# EAGLE design roboimplantschematic (EAGLE 6.1)
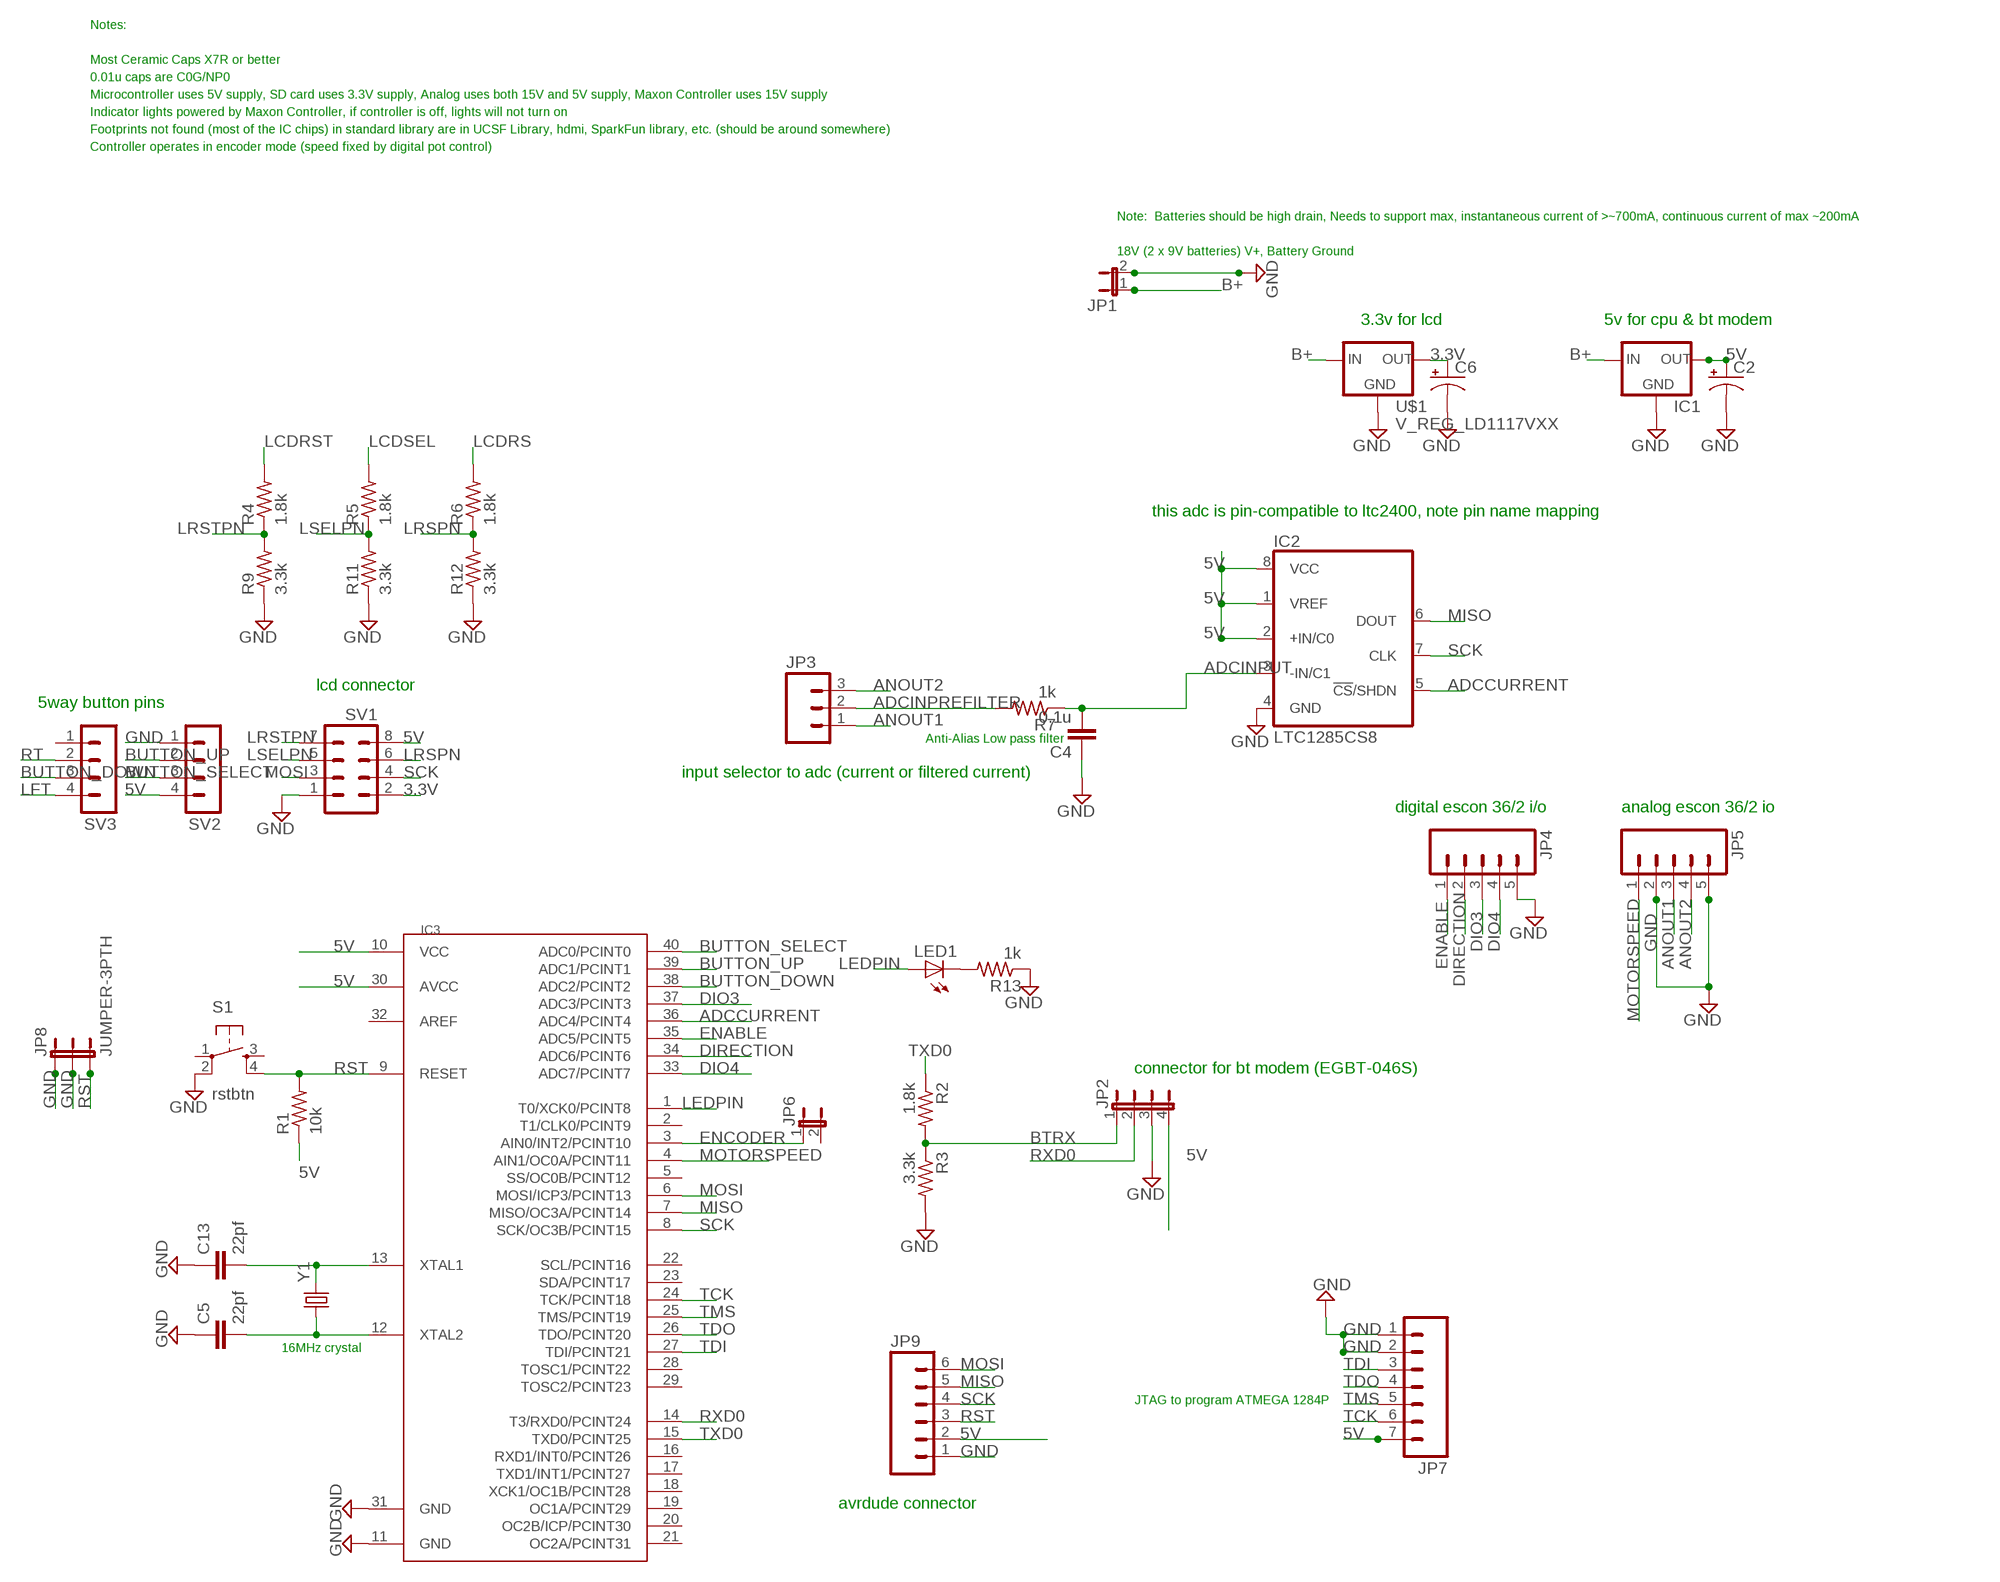
[diagram p0: schematic, sheet 1]

## Parts
C2  CAP_POLPTH2  [CPOL-RADIAL-10UF-25V]
C4  0.1u  050X030_0251  [050X030_025]
C5  22pf  050X030_0251  [050X030_025]
C6  CAP_POLPTH2  [CPOL-RADIAL-10UF-25V]
C13  22pf  050X030_0251  [050X030_025]
IC1  V_REG_78XX-TO-220  [TO-220-ALT]
IC2  LTC1285CS8  [SOIC8]
IC3  MEGA1284P  [DIL40]
JP1  JP1E  [JP1]
JP2  JP4E  [JP4]
JP3  M03LOCK_LONGPADS  [1X03_LOCK_LONGPADS]
JP4  M05PTH_LONGPADS  [1X05_LONGPADS]
JP5  M05PTH_LONGPADS  [1X05_LONGPADS]
JP6  JUMPER-2PTH  [1X02]
JP7  M07LOCK  [1X07_LOCK]
JP8  JUMPER-3PTH  [1X03]
JP9  M06SIP_LOCK  [1X06-SIP_LOCK]
LED1  LED5MM  [LED5MM]
R1  10k  R-US_0204/7  [0204/7]
R2  1.8k  R-US_0207/2V  [0207/2V]
R3  3.3k  R-US_0207/2V  [0207/2V]
R4  1.8k  R-US_0207/2V  [0207/2V]
R5  1.8k  R-US_0207/2V  [0207/2V]
R6  1.8k  R-US_0207/2V  [0207/2V]
R7  1k  R-US_0207/2V  [0207/2V]
R9  3.3k  R-US_0207/2V  [0207/2V]
R11  3.3k  R-US_0207/2V  [0207/2V]
R12  3.3k  R-US_0207/2V  [0207/2V]
R13  1k  R-US_0207/2V  [0207/2V]
S1  rstbtn  TAC_SWITCHPTH  [TACTILE-PTH]
SV1  MA04-2  [MA04-2]
SV2  MA04-1  [MA04-1]
SV3  MA04-1  [MA04-1]
U$1  V_REG_LD1117VXX  [78XXL]
Y1  CRYSTALHC49US  [HC49US]

## Nets
3.3V: C6.1(+) SV1.2 U$1.GND(OUT)
5V: C2.1(+) IC1.OUT IC2.1(VREF) IC2.2(+IN/C0) IC2.8(VCC) IC3.10(VCC) IC3.30(AVCC) JP2.4 JP7.7 JP9.2 R1.1 SV1.8 SV2.4
ADCCURRENT: IC2.5(!CS!/SHDN) IC3.36(ADC4/PCINT4)
ADCINPREFILTER: JP3.2 R7.2
ADCINPUT: C4.2 IC2.3(-IN/C1) R7.1
ANOUT1: JP3.1 JP5.3
ANOUT2: JP3.3 JP5.4
B+: IC1.IN JP1.1 U$1.OUT(IN)
BTRX: JP2.1 R2.2 R3.1
BUTTON_DOWN: IC3.38(ADC2/PCINT2) SV3.3
BUTTON_SELECT: IC3.40(ADC0/PCINT0) SV2.3
BUTTON_UP: IC3.39(ADC1/PCINT1) SV2.2
DIO3: IC3.37(ADC3/PCINT3) JP4.3
DIO4: IC3.33(ADC7/PCINT7) JP4.4
DIRECTION: IC3.34(ADC6/PCINT6) JP4.2
ENABLE: IC3.35(ADC5/PCINT5) JP4.1
ENCODER: IC3.3(AIN0/INT2/PCINT10) JP6.1
GND: C2.2(-) C4.1 C5.1 C6.2(-) C13.1 IC1.GND IC2.4(GND) IC3.11(GND) IC3.31(GND) JP1.2 JP2.3 JP4.5 JP5.2 JP5.5 JP7.1 JP7.2 JP8.1 JP8.2 JP9.1 R3.2 R9.1 R11.1 R12.1 R13.1 S1.2 SV1.1 SV2.1 U$1.IN(GND)
LCDRS: R6.2
LCDRST: R4.2
LCDSEL: R5.2
LEDPIN: IC3.1(T0/XCK0/PCINT8) LED1.A
LFT: SV3.4
LRSPN: R6.1 R12.2 SV1.6
LRSTPN: R4.1 R9.2 SV1.7
LSELPN: R5.1 R11.2 SV1.5
MISO: IC2.6(DOUT) IC3.7(MISO/OC3A/PCINT14) JP9.5
MOSI: IC3.6(MOSI/ICP3/PCINT13) JP9.6 SV1.3
MOTORSPEED: IC3.4(AIN1/OC0A/PCINT11) JP5.1
N$1: C5.2 IC3.12(XTAL2) Y1.1
N$2: C13.2 IC3.13(XTAL1) Y1.2
N$5: LED1.K(C) R13.2
RST: IC3.9(RESET) JP8.3 JP9.3 R1.2 S1.4
RT: SV3.2
RXD0: IC3.14(T3/RXD0/PCINT24) JP2.2
SCK: IC2.7(CLK) IC3.8(SCK/OC3B/PCINT15) JP9.4 SV1.4
TCK: IC3.24(TCK/PCINT18) JP7.6
TDI: IC3.27(TDI/PCINT21) JP7.3
TDO: IC3.26(TDO/PCINT20) JP7.4
TMS: IC3.25(TMS/PCINT19) JP7.5
TXD0: IC3.15(TXD0/PCINT25) R2.1
Unconnected: IC3.2(T1/CLK0/PCINT9) IC3.5(SS/OC0B/PCINT12) IC3.16(RXD1/INT0/PCINT26) IC3.17(TXD1/INT1/PCINT27) IC3.18(XCK1/OC1B/PCINT28) IC3.19(OC1A/PCINT29) IC3.20(OC2B/ICP/PCINT30) IC3.21(OC2A/PCINT31) IC3.22(SCL/PCINT16) IC3.23(SDA/PCINT17) IC3.28(TOSC1/PCINT22) IC3.29(TOSC2/PCINT23) IC3.32(AREF) JP6.2 S1.1 S1.3 SV3.1

## Notes on the sheet
- Notes:
- Most Ceramic Caps X7R or better
- 0.01u caps are C0G/NP0
- Microcontroller uses 5V supply, SD card uses 3.3V supply, Analog uses both 15V and 5V supply, Maxon Controller uses 15V supply
- Indicator lights powered by Maxon Controller, if controller is off, lights will not turn on
- Footprints not found (most of the IC chips) in standard library are in UCSF Library, hdmi, SparkFun library, etc. (should be around somewhere)
- Controller operates in encoder mode (speed fixed by digital pot control)
- Note:  Batteries should be high drain, Needs to support max, instantaneous current of >~700mA, continuous current of max ~200mA
- 18V (2 x 9V batteries) V+, Battery Ground
- 3.3v for lcd | 5v for cpu & bt modem
- this adc is pin-compatible to ltc2400, note pin name mapping
- lcd connector
- 5way button pins
- Anti-Alias Low pass filter
- input selector to adc (current or filtered current)
- digital escon 36/2 i/o | analog escon 36/2 io
- connector for bt modem (EGBT-046S)
- 16MHz crystal
- JTAG to program ATMEGA 1284P
- avrdude connector

## Library data of the parts
C2 C6 = SparkFun:CAP_POL: Capacitor Polarized These are standard SMD and PTH capacitors. Normally 10uF, 47uF, and 100uF in electrolytic and tantalum varieties. Always verify the external diameter of the through hole cap, it varies with capacity, voltage, and manufacturer. The EIA devices should be standard.
C4 C5 C13 = gm-caps-ceramic:050X030_025: 47 - 120pF Xicon Ceramic Disc 2.5mm lead spacing
IC1 = SparkFun:V_REG_78XX: Voltage Regulator Standard 7805 5V regulator. IGO (Input Ground Output). Spark Fun Electronics SKU : COM-00107
IC2 = linear-technology:LTC128*C: 3V Micropower Sampling 12-Bit A/D Converters Source: http://www.linear.com/pc/downloadDocument.do?navId=H0,C1,C1155,C1001,C1158,P1489,D3463; MPN: LTC1285CS8; OC_FARNELL: 4767585; OC_NEWARK: 56M0033
IC3 = 1284p:MEGA1284P: Atmel ATmega1284P 8-bit AVR Microcontroller
JP1 = jumper:JP1E: JUMPER
JP2 = jumper:JP4E: JUMPER
JP3 = SparkFun:M03: Header 3 Standard 3-pin 0.1" header. Use with straight break away headers (SKU : PRT-00116), right angle break away headers (PRT-00553), swiss pins (PRT-00743), machine pins (PRT-00117), and female headers (PRT-00115). Molex polarized connector foot print use with SKU : PRT-08232 with associated crimp pins and housings.
JP4 JP5 = SparkFun:M05: Header 5 Standard 5-pin 0.1" header. Use with straight break away headers (SKU : PRT-00116), right angle break away headers (PRT-00553), swiss pins (PRT-00743), machine pins (PRT-00117), and female headers (PRT-00115). Molex polarized connector foot print use with SKU : PRT-08230 with associated crimp pins and housings.
JP6 = SparkFun:JUMPER-2: Jumper Basic 0.1" spaced jumper. Use with breakaway headers.
JP7 = SparkFun:M07: Header 7 Standard 7-pin 0.1" header. Use with straight break away headers (SKU : PRT-00116), right angle break away headers (PRT-00553), swiss pins (PRT-00743), machine pins (PRT-00117), and female headers (PRT-00115). NOTES ON THE VARIANTS LOCK and LOCK_LONGPADS... This footprint was designed to help hold the alignment of a through-hole component (i.e. 7-pin header) while soldering it into place. You may notice that each hole has been shifted either up or down by 0.005 of an inch from it's more standard position (which is usually a perfectly straight line). This slight alteration caused the pins (the squares in the middle) to touch the edges of the holes. Because they are alternating, it causes a "brace" to hold the header in place. 0.005 has proven to be the perfect amount of "off-center" position when using our standard breakaway headers. Although looks a little odd when you look at the bare footprint, once you have a header in there, the alteration is very hard to notice. Also, if you push a header all the way into place, it is covered up entirely on the bottom side. This idea of altering the position of holes to aid alignment will be further integrated into the Sparkfun Library for other footprints. It can help hold any component with 3 or more connection pins.
JP8 = SparkFun:JUMPER-3
JP9 = SparkFun:M06: Header 6 Standard 6-pin 0.1" header. Use with straight break away headers (SKU : PRT-00116), right angle break away headers (PRT-00553), swiss pins (PRT-00743), machine pins (PRT-00117), and female headers (PRT-00115). Molex polarized connector foot print use with SKU : PRT-08094 with associated crimp pins and housings. NOTES ON THE VARIANTS LOCK and LOCK_LONGPADS... This footprint was designed to help hold the alignment of a through-hole component (i.e. 6-pin header) while soldering it into place. You may notice that each hole has been shifted either up or down by 0.005 of an inch from it's more standard position (which is a perfectly straight line). This slight alteration caused the pins (the squares in the middle) to touch the edges of the holes. Because they are alternating, it causes a "brace" to hold the component in place. 0.005 has proven to be the perfect amount of "off-center" position when using our standard breakaway headers. Although looks a little odd when you look at the bare footprint, once you have a header in there, the alteration is very hard to notice. Also, if you push a header all the way into place, it is covered up entirely on the bottom side. This idea of altering the position of holes to aid alignment will be further integrated into the Sparkfun Library for other footprints. It can help hold any component with 3 or more connection pins.
LED1 = led:LED: LED OSRAM: - CHIPLED LG R971, LG N971, LY N971, LG Q971, LY Q971, LO R971, LY R971 LH N974, LH R974 LS Q976, LO Q976, LY Q976 LO Q996 - Hyper CHIPLED LW Q18S LB Q993, LB Q99A, LB R99A - SideLED LS A670, LO A670, LY A670, LG A670, LP A670 LB A673, LV A673, LT A673, LW A673 LH A674 LY A675 LS A676, LA A676, LO A676, LY A676, LW A676 LS A679, LY A679, LG A679 - Hyper Micro SIDELED® LS Y876, LA Y876, LO Y876, LY Y876 LT Y87S - SmartLED LW L88C, LW L88S LB L89C, LB L89S, LG L890 LS L89K, LO L89K, LY L89K LS L896, LA L896, LO L896, LY L896 - TOPLED LS T670, LO T670, LY T670, LG T670, LP T670 LSG T670, LSP T670, LSY T670, LOP T670, LYG T670 LG T671, LOG T671, LSG T671 LB T673, LV T673, LT T673, LW T673 LH T674 LS T676, LA T676, LO T676, LY T676, LB T676, LH T676, LSB T676, LW T676 LB T67C, LV T67C, LT T67C, LS T67K, LO T67K, LY T67K, LW E67C LS E67B, LA E67B, LO E67B, LY E67B, LB E67C, LV E67C, LT E67C LW T67C LS T679, LY T679, LG T679 LS T770, LO T770, LY T770, LG T770, LP T770 LB T773, LV T773, LT T773, LW T773 LH T774 LS E675, LA E675, LY E675, LS T675 LS T776, LA T776, LO T776, LY T776, LB T776 LHGB T686 LT T68C, LB T68C - Hyper Mini TOPLED® LB M676 - Mini TOPLED Santana® LG M470 LS M47K, LO M47K, LY M47K Source: http://www.osram.convergy.de LUXEON: - LUMILED® LXK2-PW12-R00, LXK2-PW12-S00, LXK2-PW14-U00, LXK2-PW14-V00 LXK2-PM12-R00, LXK2-PM12-S00, LXK2-PM14-U00 LXK2-PE12-Q00, LXK2-PE12-R00, LXK2-PE12-S00, LXK2-PE14-T00, LXK2-PE14-U00 LXK2-PB12-K00, LXK2-PB12-L00, LXK2-PB12-M00, LXK2-PB14-N00, LXK2-PB14-P00, LXK2-PB14-Q00 LXK2-PR12-L00, LXK2-PR12-M00, LXK2-PR14-Q00, LXK2-PR14-R00 LXK2-PD12-Q00, LXK2-PD12-R00, LXK2-PD12-S00 LXK2-PH12-R00, LXK2-PH12-S00 LXK2-PL12-P00, LXK2-PL12-Q00, LXK2-PL12-R00 Source: www.luxeon.com KINGBRIGHT: KA-3528ASYC Source: www.kingbright.com
R1-R7 R9 R11-R13 = rcl:R-US_: RESISTOR, American symbol
S1 = SparkFun:TAC_SWITCH: Momentary Switch Button commonly used for reset or general input. Spark Fun Electronics SKU : COM-00097
SV1 = con-lstb:MA04-2: PIN HEADER; OC_FARNELL: unknown; OC_NEWARK: unknown
SV2 SV3 = con-lstb:MA04-1: PIN HEADER; OC_FARNELL: unknown; OC_NEWARK: unknown
U$1 = SparkFun:V_REG_LD1117VXX: LD1117VXX voltage regulator. We carry the 3.3V version (COM-00526) in TO-220 package.
Y1 = SparkFun:CRYSTAL: Crystals Various standard crystals. Proven footprints. Spark Fun Electronics SKU : COM-00534

## Board
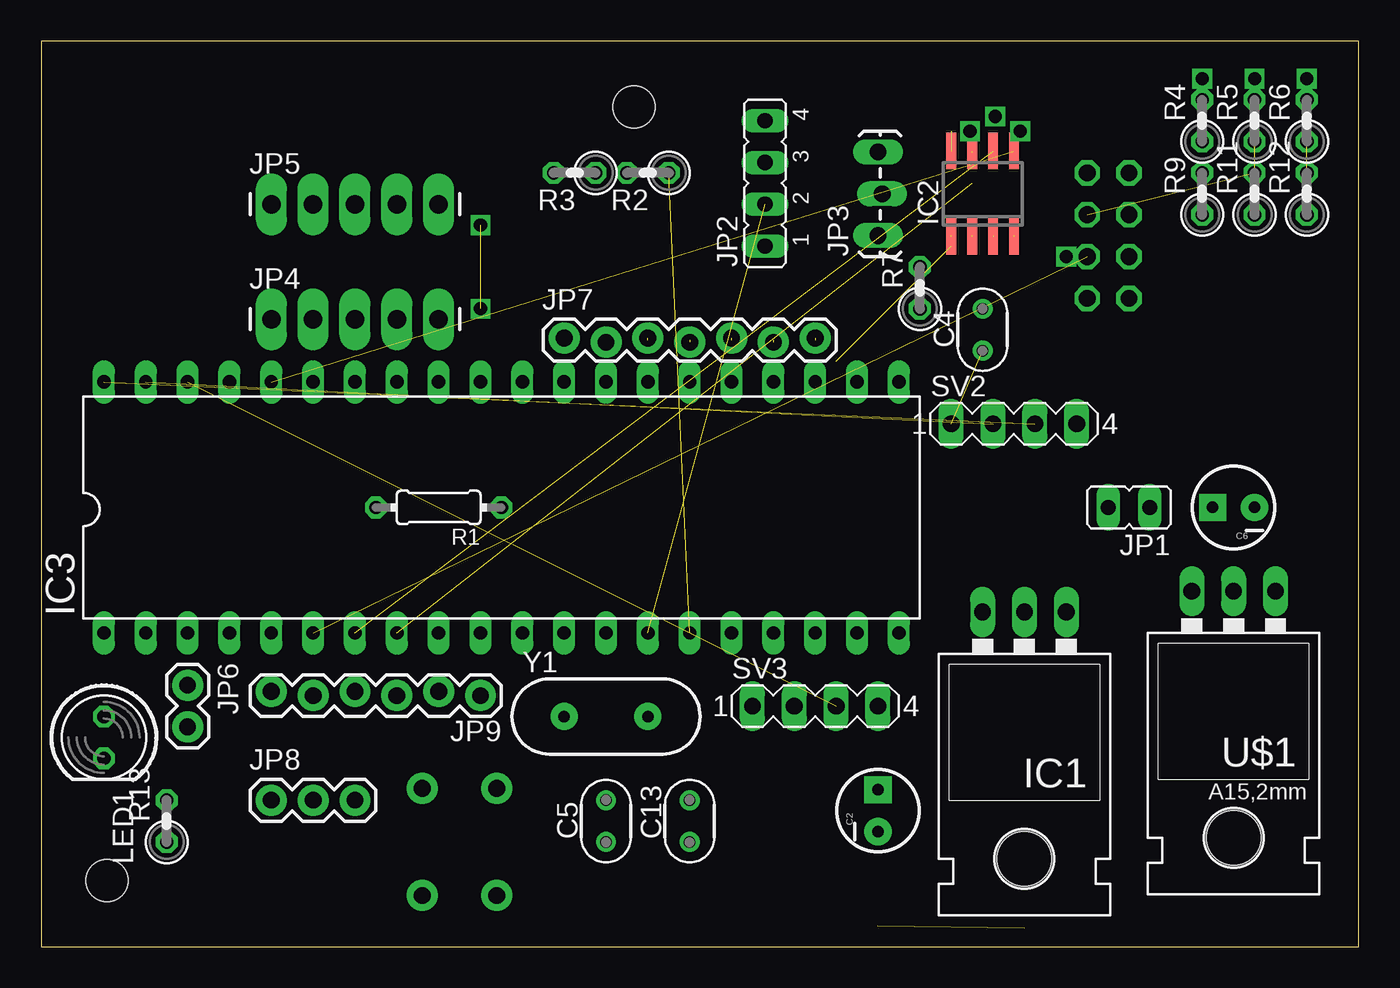
[diagram p1: board, top side]
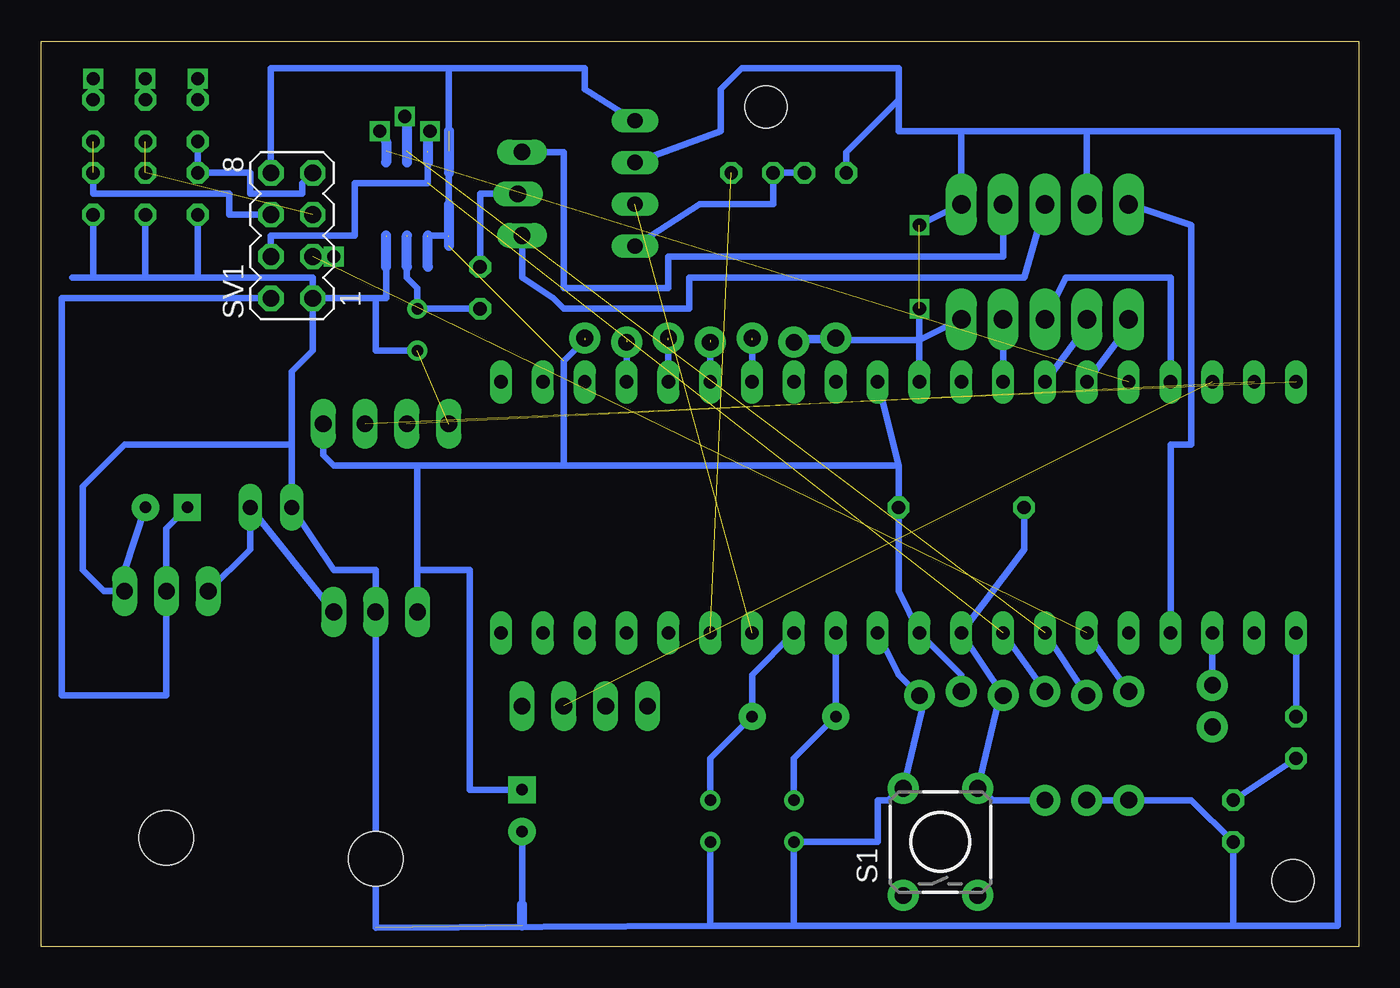
[diagram p2: board, bottom side, seen from below]

Size 79.99 x 54.99 mm. Coordinates in mm from the lower left corner, seen from the top.
Outline: 0,0 79.99,0 79.99,54.99 0,54.99 0,0
Copper layers (1*16): Top 0.035mm / dielectric 1.5mm / Bottom 0.035mm
Design rules: minimum track width 10mil, minimum drill 24mil, track to track 8mil, track to pad 8mil, pad to pad 8mil, via to via 8mil, smd to smd 8mil, copper to edge 40mil, drill to drill 8mil, minimum pad ring 10mil, minimum via ring 8mil, stop-mask expansion 4mil, vias tented up to drill 0mil, thermal gap 10mil
Holes 2.54 mm at 4,4 36,51

### Footprints (pad centres in the part's own frame; a part is rotated, then mirrored left to right if it is on the bottom)
CPOL-RADIAL-10UF-25V = drill 0.7 pad 1.651 square: 1 1.27,0 | drill 0.7 pad 1.651: 2 -1.27,0
050X030_025 = drill 0.7: 1 -1.27,0; 2 1.27,0
TO-220-ALT = drill 1.016 long: GND 0,-3.81; IN -2.54,-3.81; OUT 2.54,-3.81 | hole 3.302: 0,11.176
SOIC8 = smd 0.6 x 2.2: 1 -1.905,-2.6; 2 -0.635,-2.6; 3 0.635,-2.6; 4 1.905,-2.6; 5 1.905,2.6; 6 0.635,2.6; 7 -0.635,2.6; 8 -1.905,2.6
DIL40 = drill 0.813 long: 1 -24.13,-7.62; 2 -21.59,-7.62; 3 -19.05,-7.62; 4 -16.51,-7.62; 5 -13.97,-7.62; 6 -11.43,-7.62; 7 -8.89,-7.62; 8 -6.35,-7.62; 9 -3.81,-7.62; 10 -1.27,-7.62; 11 1.27,-7.62; 12 3.81,-7.62; 13 6.35,-7.62; 14 8.89,-7.62; 15 11.43,-7.62; 16 13.97,-7.62; 17 16.51,-7.62; 18 19.05,-7.62; 19 21.59,-7.62; 20 24.13,-7.62; 21 24.13,7.62; 22 21.59,7.62; 23 19.05,7.62; 24 16.51,7.62; 25 13.97,7.62; 26 11.43,7.62; 27 8.89,7.62; 28 6.35,7.62; 29 3.81,7.62; 30 1.27,7.62; 31 -1.27,7.62; 32 -3.81,7.62; 33 -6.35,7.62; 34 -8.89,7.62; 35 -11.43,7.62; 36 -13.97,7.62; 37 -16.51,7.62; 38 -19.05,7.62; 39 -21.59,7.62; 40 -24.13,7.62
JP1 = drill 0.914 long: 1 0,-1.27; 2 0,1.27
JP4 = drill 0.914 long: 1 -3.81,0; 2 -1.27,0; 3 1.27,0; 4 3.81,0
1X03_LOCK_LONGPADS = drill 1.016 long: 1 0,0; 2 2.54,-0.254; 3 5.08,0
1X05_LONGPADS = drill 1.118 pad 1.88 long: 1 0,0; 2 2.54,0; 3 5.08,0; 4 7.62,0; 5 10.16,0
1X02 = drill 1.016 pad 1.88: 1 0,0; 2 2.54,0
1X07_LOCK = drill 1.016 pad 1.88: 1 0,0.127; 2 2.54,-0.127; 3 5.08,0.127; 4 7.62,-0.127; 5 10.16,0.127; 6 12.7,-0.127; 7 15.24,0.127
1X03 = drill 1.016 pad 1.88: 1 0,0; 2 2.54,0; 3 5.08,0
1X06-SIP_LOCK = drill 1.016 pad 1.88: 1 0,0; 2 2.54,-0.254; 3 5.08,0; 4 7.62,-0.254; 5 10.16,0; 6 12.7,-0.254
LED5MM = drill 0.813 octagon: A -1.27,0; K 1.27,0
0204/7 = drill 0.813 octagon: 1 -3.81,0; 2 3.81,0
0207/2V = drill 0.813 octagon: 1 -1.27,0; 2 1.27,0
TACTILE-PTH = drill 1.016 pad 1.88: 1 -3.251,2.261; 2 3.251,2.261; 3 -3.251,-2.261; 4 3.251,-2.261
MA04-2 = drill 1.016 octagon: 1 -3.81,-1.27; 2 -3.81,1.27; 3 -1.27,-1.27; 4 -1.27,1.27; 5 1.27,-1.27; 6 1.27,1.27; 7 3.81,-1.27; 8 3.81,1.27
MA04-1 = drill 1.016 long: 1 -3.81,0; 2 -1.27,0; 3 1.27,0; 4 3.81,0
78XXL = drill 1.016 long: GND 0,-3.81; IN -2.54,-3.81; OUT 2.54,-3.81 | hole 3.302: 0,11.176
HC49US = drill 0.7 pad 1.651: 1 -2.54,0; 2 2.54,0

### Placement (x,y rotation side)
C2  50.8,8.26 90 top
C4  57.15,37.47 90 top
C5  34.29,7.62 90 top
C6  72.39,26.67 180 top
C13  39.37,7.62 90 top
IC1  59.69,16.51 180 top
IC2  57.15,45.72 0 top
IC3  27.94,26.67 0 top
JP1  66.04,26.67 90 top
JP2  43.94,46.35 90 top
JP3  50.8,43.18 90 top
JP4  13.97,38.1 0 top
JP5  13.97,45.09 0 top
JP6  8.89,15.88 270 top
JP7  31.75,36.83 0 top
JP8  13.97,8.89 0 top
JP9  26.67,15.24 180 top
LED1  3.81,12.7 270 top
R1  24.13,26.67 180 top
R2  36.83,46.99 180 top
R3  32.38,46.99 180 top
R4  70.48,50.16 90 top
R5  73.66,50.16 90 top
R6  76.83,50.16 90 top
R7  53.34,40.01 90 top
R9  70.48,45.72 90 top
R11  73.66,45.72 90 top
R12  76.83,45.72 90 top
R13  7.62,7.62 90 top
S1  25.4,6.35 90 bottom
SV1  64.77,43.18 90 bottom
SV2  59.05,31.75 0 top
SV3  46.99,14.61 0 top
U$1  72.39,17.78 180 top
Y1  34.29,13.97 0 top

### Tracks (layer width: path | path; a pad name or v marks a point on that pad's centre or on a via)
3.3V
  Bottom 0.406: SV1.2 78.74,39.37 78.74,15.24 72.39,15.24 U$1.GND 72.39,25.4 C6.1
5V  (5 unrouted)
  Bottom 0.406: IC1.OUT 57.15,22.86 | 57.15,22.86 57.15,29.21 | 57.15,29.21 48.26,29.21 | 48.26,29.21 27.94,29.21 | 27.94,29.21 R1.1 27.94,21.59 IC3.10 24.13,16.51 JP9.2 | 46.99,36.83 48.26,35.56 48.26,29.21 | 55.24,53.34 46.99,53.34 46.99,52.07 JP2.4 | 55.24,53.34 66.04,53.34 SV1.8 | 27.94,29.21 IC3.30 | 55.24,46.99 55.24,45.09 55.24,43.18 56.52,43.18 | 55.24,49.53 55.24,53.34 | 57.15,22.86 53.98,22.86 53.98,9.53 C2.1 | SV2.4 62.87,29.84 62.23,29.21 57.15,29.21
  Bottom 0.61: 56.52,41.27 56.52,43.18 | 55.24,45.09 55.24,42.55 | 55.24,49.53 55.24,46.99
ADCCURRENT  (1 unrouted)
ADCINPREFILTER
  Bottom 0.406: JP3.2 53.34,45.72 R7.2
ADCINPUT  (1 unrouted)
  Bottom 0.406: 57.78,41.27 57.78,40.64 57.15,40.01 C4.2 R7.1
  Bottom 0.61: 57.78,41.27 57.78,43.18
ANOUT1
  Bottom 0.406: JP5.3 20.32,40.64 40.64,40.64 40.64,38.73 48.26,38.73 48.9,39.37 50.8,40.64 JP3.1
ANOUT2
  Bottom 0.406: JP3.3 48.26,48.26 48.26,40.01 41.91,40.01 41.91,41.91 21.59,41.91 JP5.4
B+
  Bottom 0.406: U$1.OUT 67.31,24.13 JP1.1 IC1.IN
BTRX
  Bottom 0.406: R3.1 R2.2 35.56,45.09 40.01,45.09 JP2.1
BUTTON_DOWN  (1 unrouted)
BUTTON_SELECT  (1 unrouted)
BUTTON_UP  (1 unrouted)
DIO3
  Bottom 0.406: IC3.37 11.43,40.64 17.78,40.64 JP4.3
DIO4
  Bottom 0.406: JP4.4 IC3.33
DIRECTION
  Bottom 0.406: IC3.34 17.14,36.83 JP4.2
ENABLE
  Bottom 0.406: IC3.35 14.61,36.83 JP4.1
ENCODER
  Bottom 0.406: IC3.3 JP6.1
GND  (via drill 0.79)  (4 unrouted)
  Bottom 0.406: IC3.11 27.94,16.51 JP9.1 26.39,14.96 S1.2 27.66,9.53 27.94,9.53 28.57,8.89 29.21,8.89 29.21,6.35 C5.1 34.29,1.27 | 64.77,30.48 JP1.2 62.23,22.86 59.69,22.86 IC1.GND 59.69,1.14 39.37,1.27 | 64.77,30.48 74.93,30.48 77.47,27.94 77.47,22.86 76.2,21.59 U$1.IN 74.93,22.86 C6.2 | 34.29,1.27 7.62,1.27 | C13.1 39.37,1.27 | 39.37,1.27 34.29,1.27 | 7.62,1.27 R13.1 10.16,8.89 JP8.1 JP8.2 | 7.62,1.27 1.27,1.27 1.27,49.53 16.51,49.53 | 16.51,49.53 24.13,49.53 | 24.13,49.53 27.94,49.53 27.94,51.44 | 27.94,51.44 27.94,53.34 37.47,53.34 38.73,52.07 38.73,49.53 JP2.3 | IC3.31 26.67,36.83 | 26.67,36.83 JP4.5 | SV1.1 59.69,39.37 | 59.69,39.37 59.05,39.37 59.05,41.27 | 64.77,30.48 64.77,34.92 63.5,36.2 SV1.1 | JP5.2 16.51,49.53 | 24.13,49.53 JP5.5 v26.67,43.81 | C2.2 50.8,2.54 50.8,1.91 | C4.1 59.69,36.2 59.69,39.37 | SV1.1 63.5,40.64 70.48,40.64 | 70.48,40.64 73.66,40.64 | 73.66,40.64 76.83,40.64 | 76.83,40.64 78.11,40.64 | 70.48,40.64 R9.1 | R11.1 73.66,40.64 | R12.1 76.83,40.64 | 26.67,36.83 34.29,36.83 JP7.2 34.29,36.96 JP7.1 | R3.2 31.11,48.26 27.94,51.44 | v26.67,38.73 26.67,36.83
  Bottom 0.61: 59.05,41.27 59.05,43.18 | 50.8,1.27 50.8,2.54
LEDPIN
  Bottom 0.406: LED1.A IC3.1
LRSPN  (1 unrouted)
  Bottom 0.406: R12.2 76.83,45.72 68.58,45.72 68.58,44.45 SV1.6
LRSTPN
  Bottom 0.406: R4.1 R9.2 67.31,46.99 67.31,45.72 64.14,45.72 64.14,46.35 SV1.7
LSELPN  (2 unrouted)
MISO  (1 unrouted)
  Bottom 0.406: JP9.5 IC3.7
MOSI  (1 unrouted)
  Bottom 0.406: JP9.6 IC3.6
MOTORSPEED
  Bottom 0.406: IC3.4 11.43,30.48 10.16,30.48 10.16,43.81 JP5.1
N$1
  Bottom 0.406: IC3.12 Y1.1 34.29,11.43 C5.2
N$2
  Bottom 0.406: IC3.13 36.83,16.51 Y1.2 39.37,11.43 C13.2
N$3  (via drill 0.79)
  other vias: 59.44,49.53
N$4  (via drill 0.79)
  other vias: 57.91,50.42
N$5
  Bottom 0.406: R13.2 LED1.K
N$6  (via drill 0.79)
  other vias: 56.39,49.53
N$7  (via drill 0.79)
  other vias: 62.23,41.91
N$8  (via drill 0.79)
  other vias: 70.48,52.7
N$9  (via drill 0.79)
  other vias: 73.66,52.7
N$10  (via drill 0.79)
  other vias: 76.83,52.7
N$11
  Bottom 0.61: 57.78,50.04 57.78,47.62
N$12
  Bottom 0.61: 59.05,48.9 59.05,47.62
RST
  Bottom 0.406: R1.2 20.32,24.13 IC3.9 JP9.3 21.87,14.96 S1.4 23.14,9.53 22.86,9.53 22.23,8.89 JP8.3
RXD0  (1 unrouted)
SCK  (2 unrouted)
  Bottom 0.254: 56.52,48.9 56.52,48.26
  Bottom 0.406: JP9.4 IC3.8 | SV1.4 66.04,43.18 60.96,43.18 60.96,46.35 56.52,46.35 56.52,47.62 56.52,48.26
  Bottom 0.61: 56.52,48.9 56.52,47.62
TCK  (1 unrouted)
  Bottom 0.406: IC3.24 44.45,36.83
TDI  (1 unrouted)
  Bottom 0.406: IC3.27 36.83,36.83
TDO  (1 unrouted)
  Bottom 0.406: IC3.26 39.37,36.83
TMS  (1 unrouted)
  Bottom 0.406: IC3.25 41.91,36.83
TXD0  (1 unrouted)